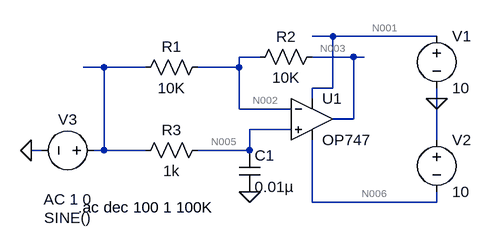
[diagram p0: schematic ALL_PASS_FILTER.asc]
ALL_PASS_FILTER.asc, the LTspice schematic file:
Version 4
SHEET 1 880 680
WIRE 256 0 224 0
WIRE 416 0 256 0
WIRE 144 32 112 32
WIRE 288 32 224 32
WIRE 304 32 288 32
WIRE -96 48 -128 48
WIRE -32 48 -96 48
WIRE 112 48 112 32
WIRE 112 48 48 48
WIRE 256 80 256 0
WIRE 256 80 224 80
WIRE 224 96 224 80
WIRE 416 96 416 80
WIRE 112 112 112 48
WIRE 192 112 112 112
WIRE 288 128 288 32
WIRE 288 128 256 128
WIRE 192 144 128 144
WIRE 416 160 416 96
WIRE -192 176 -208 176
WIRE -96 176 -96 48
WIRE -96 176 -112 176
WIRE -32 176 -96 176
WIRE 128 176 128 144
WIRE 128 176 48 176
WIRE 224 256 224 160
WIRE 416 256 416 240
WIRE 416 256 224 256
FLAG 128 240 0
FLAG 416 96 0
FLAG -208 176 0
SYMBOL OpAmps\\OP747 224 64 R0
SYMATTR InstName U1
SYMBOL res 64 32 R90
WINDOW 0 0 56 VBottom 2
WINDOW 3 32 56 VTop 2
SYMATTR InstName R1
SYMATTR Value 10K
SYMBOL res 240 16 R90
WINDOW 0 0 56 VBottom 2
WINDOW 3 32 56 VTop 2
SYMATTR InstName R2
SYMATTR Value 10K
SYMBOL res 64 160 R90
WINDOW 0 0 56 VBottom 2
WINDOW 3 32 56 VTop 2
SYMATTR InstName R3
SYMATTR Value 1k
SYMBOL cap 112 176 R0
SYMATTR InstName C1
SYMATTR Value 0.01µ
SYMBOL voltage 416 -16 R0
WINDOW 123 0 0 Left 0
WINDOW 39 0 0 Left 0
SYMATTR InstName V1
SYMATTR Value 10
SYMBOL voltage 416 144 R0
WINDOW 123 0 0 Left 0
WINDOW 39 0 0 Left 0
SYMATTR InstName V2
SYMATTR Value 10
SYMBOL voltage -96 176 R90
WINDOW 0 -32 56 VBottom 2
WINDOW 3 88 56 VTop 2
WINDOW 123 60 56 VTop 2
WINDOW 39 0 0 Left 0
SYMATTR InstName V3
SYMATTR Value SINE()
SYMATTR Value2 AC 1 0
TEXT -136 264 Left 2 !.ac dec 100 1 100K

The netlist it stands for:
* ALL_PASS_FILTER.asc
XU1 N005 N002 N001 N006 N003 OP747  ; pins In+ In- V+ V- OUT
R1 N002 N004 10K
R2 N003 N002 10K
R3 N005 N004 1k
C1 N005 0 0.01µ
V1 N001 0 10
V2 0 N006 10
V3 N004 0 SINE() AC 1 0
.ac dec 100 1 100K
.backanno
.end

* Results of the author's LTspice run, read from the files saved beside the schematic
* Operating Point, zero values left out:
*   V(n002) = 91.21 µV
*   V(n006) = -10 V
*   V(n001) = 10 V
*   V(n005) = 11.21 µV
*   V(n003) = 90.29 µV
*   I(R3) = 11.21 nA
*   I(R2) = -92.82 pA
*   I(R1) = 9.121 nA
*   I(V3) = 20.34 nA
*   I(V2) = -268.6 µA
*   I(V1) = -268.6 µA
*   Ix(u1:1) = -11.21 nA
*   Ix(u1:2) = -9.214 nA
*   Ix(u1:99) = 268.6 µA
*   Ix(u1:50) = -268.6 µA
*   Ix(u1:45) = 92.82 pA
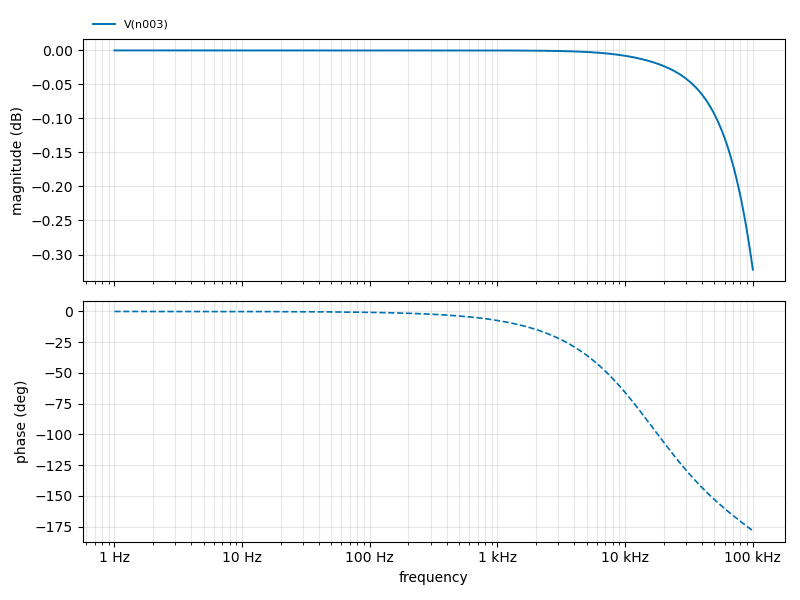
[diagram p1: AC Analysis of ALL_PASS_FILTER.asc, plotted from the saved traces]
* AC Analysis, 1 run:
*   V(n003): 0.00 dB at 1 Hz, -0.32 dB at 100 kHz, peak 0.00 dB at 1 Hz